# Altium schematic sheet ATMega1284p.SchDoc
size A; SheetNumber: 3; SheetTotal: 4
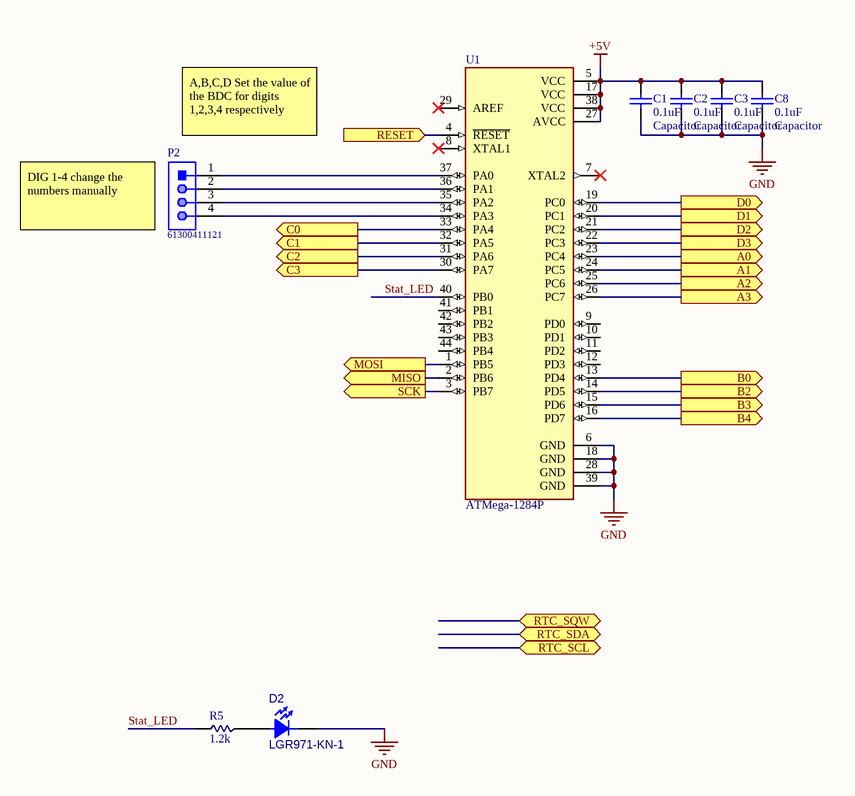
[diagram p0: ATMega1284p.SchDoc]

## Parts
C1  value 0.1uF  Type: Capacitor  [FOOTPRINT-1206-GEN]  (hidden comment: Capacitor - 0.1uF - 1206)
C2  value 0.1uF  Type: Capacitor  [FOOTPRINT-1206-GEN]  (hidden comment: Capacitor - 0.1uF - 1206)
C3  value 0.1uF  Type: Capacitor  [FOOTPRINT-1206-GEN]  (hidden comment: Capacitor - 0.1uF - 1206)
C8  value 0.1uF  Type: Capacitor  [FOOTPRINT-1206-GEN]  (hidden comment: Capacitor - 0.1uF - 1206)
D2  LGR971-KN-1  [FOOTPRINT-OSRAM-CHIPLED-0805-1A2K]
P2  61300411121  [61300411121]
R5  value 1.2k  [FOOTPRINT-0805-GEN]  (hidden comment: RMCF0805FT1K20)
U1  ATMega-1284P  [QFP80P1200X1200X120-44N]

## Ports
A0 (out), A1 (out), A2 (out), A3 (out), B0 (out), B2 (out), B3 (out), B4 (out), C0 (out), C1 (out), C2 (out), C3 (out), D0 (out), D1 (out), D2 (out), D3 (out), MISO (out), MOSI (out), RESET (in), RTC_SCL (bidir), RTC_SDA (bidir), RTC_SQW (bidir), SCK (out)

## Nets
+5V: C1.2 C2.2 C3.2 C8.2 U1.5(VCC) U1.17(VCC) U1.27(AVCC) U1.38(VCC)
GND: C1.1 C2.1 C3.1 C8.1 D2.2(K) U1.6(GND) U1.18(GND) U1.28(GND) U1.39(GND)
A0: U1.23(PC4) ; port A0
A1: U1.24(PC5) ; port A1
A2: U1.25(PC6) ; port A2
A3: U1.26(PC7) ; port A3
B0: U1.13(PD4) ; port B0
B2: U1.14(PD5) ; port B2
B3: U1.15(PD6) ; port B3
B4: U1.16(PD7) ; port B4
C0: U1.33(PA4) ; port C0
C1: U1.32(PA5) ; port C1
C2: U1.31(PA6) ; port C2
C3: U1.30(PA7) ; port C3
D0: U1.19(PC0) ; port D0
D1: U1.20(PC1) ; port D1
D2: U1.21(PC2) ; port D2
D3: U1.22(PC3) ; port D3
MISO: U1.2(PB6) ; port MISO
MOSI: U1.1(PB5) ; port MOSI
RESET: U1.4(~{RESET}) ; port RESET
SCK: U1.3(PB7) ; port SCK
Stat_LED: R5.2 U1.40(PB0)
NetD2_1: D2.1(A) R5.1
NetP2_1: P2.1 U1.37(PA0)
NetP2_2: P2.2 U1.36(PA1)
NetP2_3: P2.3 U1.35(PA2)
NetP2_4: P2.4 U1.34(PA3)

Not connected (* = marked no-connect by the designer): U1 7(XTAL2)* 8(XTAL1)* 9(PD0) 10(PD1) 11(PD2) 12(PD3) 29(AREF)* 41(PB1) 42(PB2) 43(PB3) 44(PB4)

## Notes on the sheet
- (near P2) A,B,C,D Set the value of the BDC for digits 1,2,3,4 respectively
- (near P2) DIG 1-4 change the numbers manually

## Library data of the parts
C1-C3 C8 = CMP-001-00096-1: CAP CER 0.1UF 50V X7R 1206; Part Number: 1276-7034-1-ND; PackageReference: RAD-0.3; Published: 8-Jun-2000; Source: Generic.SchLib; Design Item ID: Capacitor-Generic-1206; LatestRevisionNote: Re-released for DXP Platform.; PackageDescription: Radial Cap, Thru-Hole; 2 Leads; 0.3 in Pin Spacing; Publisher: Altium Limited
D2 = CMP-017-000003-2: LED Uni-Color Green 572nm 2-Pin Chip 0805(2012Metric) T/R; Part Number: 475-1410-1-ND; Current - Maximum: 25mA; Current - Test: 20mA; Forward Voltage: 2.2V; Design Item ID: LED-OSRAM-LG-R971-KN-1; Source: Discrete.SchLib
P2 = CMP-1502-01064-1: THT Vertical Pin Header WR-PHD, Pitch 2.54 mm, Single Row, 4 pins; Manufacturer: Wurth Elektronik; Withstanding Voltage: 500VAC; Rated Current: 3A; Working Voltage: 250VAC; Pin Number: 4; Gender: Male; Contact Resistance: 20mOhm; Pitch: 2.54mm; Manufacturer URL: http://www.we-online.de; Operating Temperature: -40to105degC; Packaging: Bag; Mounting Technology: THT; Package Reference: 61300411121; Datasheet URL: https://katalog.we-online.de/em/datasheet/6130xx11121.pdf; Publisher: WurthElektronik; Part Number: 61300411121; Row Number: Single; Orientation: Vertical
R5 = CMP-009-00185-2: Res Thick Film 0805 1.2K Ohm 1% 0.125W ±100ppm/°C Molded SMD Paper T/R; Design Item ID: Resistor-Generic-0805-2012; Source: Generic.SchLib; Type: Resistor